# Altium schematic sheet THS788_2.SchDoc: FIT_PM12 board
size 420 x 297 mm; CheckedBy: G.Kasprowicz; Author: INR Moscow; CompanyName: WUT ISE; DrawnBy: M.Podgórski; Organization: WUT ISE; Address1: PW ISE; Address2: Nowowiejska 15/19 00-665 Warsaw; Address3: gkasprow@gmail.com; DocumentNumber: 23; Revision: 2; SheetNumber: 34; SheetTotal: 34; ModifiedBy: -; CheckedDate: -; Title2: TDC2; DivGrp: WUT ISE; Designer: INR RAS; ModifiedDate: -; ProjectName: Sensor Box
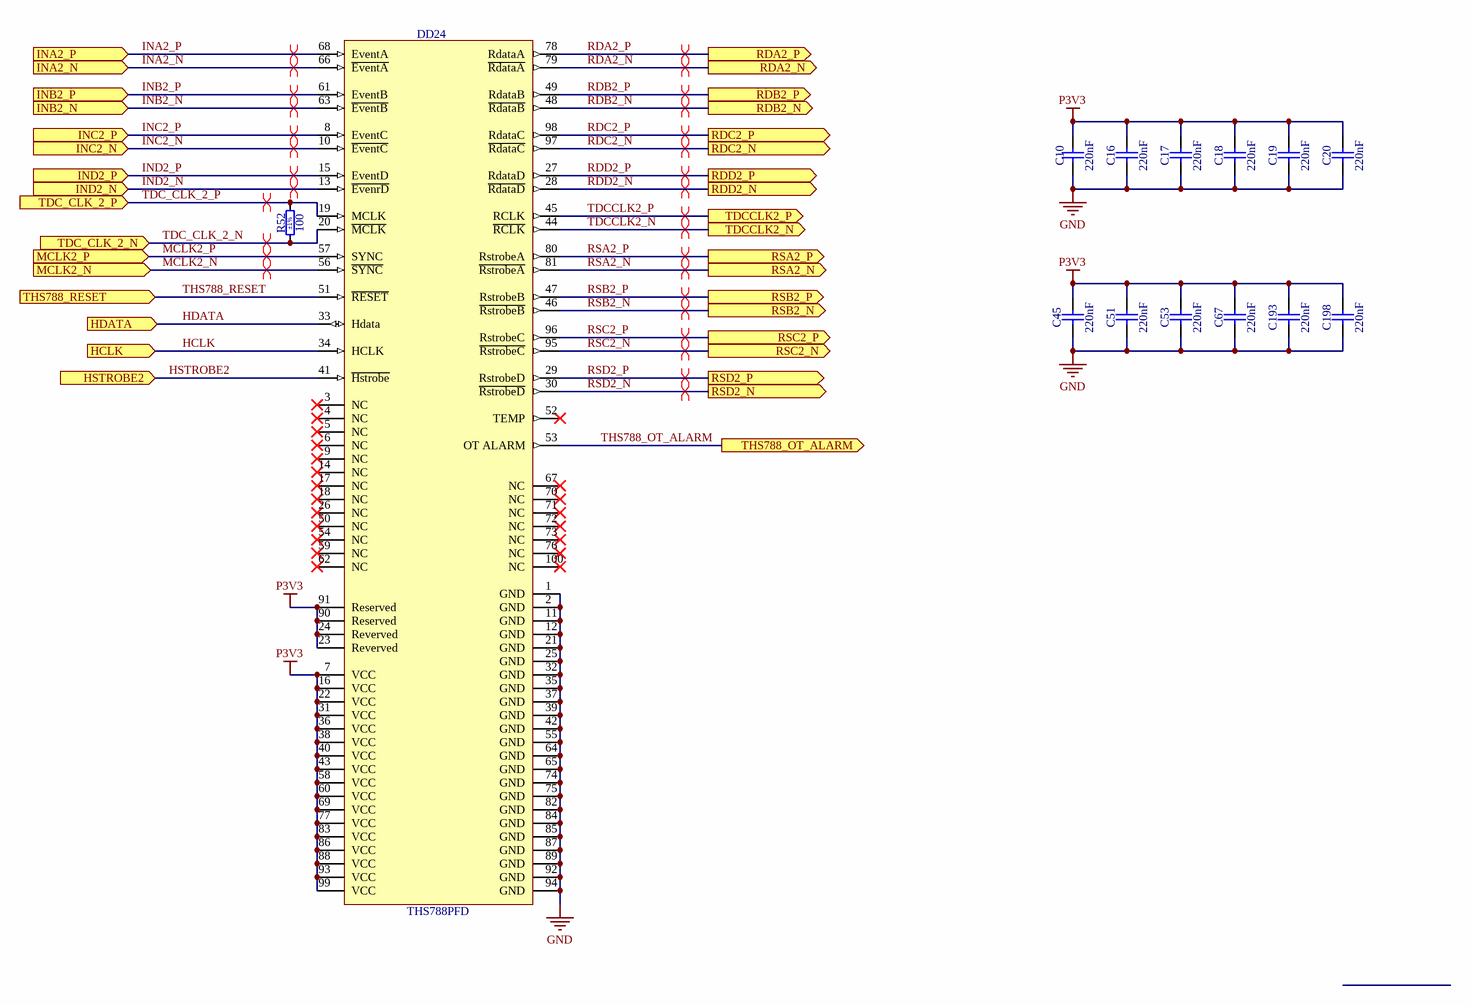
[diagram p0: THS788_2.SchDoc]

## Parts
C10  220nF  [CAPC2012X135N]
C16  220nF  [CAPC2012X135N]
C17  220nF  [CAPC2012X135N]
C18  220nF  [CAPC2012X135N]
C19  220nF  [CAPC2012X135N]
C20  220nF  [CAPC2012X135N]
C45  220nF  [CAPC2012X135N]
C51  220nF  [CAPC2012X135N]
C53  220nF  [CAPC2012X135N]
C67  220nF  [CAPC2012X135N]
C193  220nF  [CAPC2012X135N]
C198  220nF  [CAPC2012X135N]
DD24  THS788PFD  [TEXAS_PFD (S-PQFP-G100)]
R52  100  Tolerance: ±1%  [RESC1608X55N]

## Ports
HCLK (in), HDATA (in), HSTROBE2 (in), INA2_N (in), INA2_P (in), INB2_N (in), INB2_P (in), INC2_N (in), INC2_P (in), IND2_N (in), IND2_P (in), MCLK2_N (in), MCLK2_P (in), RDA2_N (out), RDA2_P (out), RDB2_N (out), RDB2_P (out), RDC2_N (out), RDC2_P (out), RDD2_N (out), RDD2_P (out), RSA2_N (out), RSA2_P (out), RSB2_N (out), RSB2_P (out), RSC2_N (out), RSC2_P (out), RSD2_N (out), RSD2_P (out), TDC_CLK_2_N (in), TDC_CLK_2_P (in), TDCCLK2_N (out), TDCCLK2_P (out), THS788_OT_ALARM (out), THS788_RESET (in)

## Nets
GND: C10.1 C16.1 C17.1 C18.1 C19.1 C20.1 C45.1 C51.1 C53.1 C67.1 C193.1 C198.1 DD24.1(GND) DD24.2(GND) DD24.11(GND) DD24.12(GND) DD24.21(GND) DD24.25(GND) DD24.32(GND) DD24.35(GND) DD24.37(GND) DD24.39(GND) DD24.42(GND) DD24.55(GND) DD24.64(GND) DD24.65(GND) DD24.74(GND) DD24.75(GND) DD24.82(GND) DD24.84(GND) DD24.85(GND) DD24.87(GND) DD24.89(GND) DD24.92(GND) DD24.94(GND)
P3V3: C10.2 C16.2 C17.2 C18.2 C19.2 C20.2 C45.2 C51.2 C53.2 C67.2 C193.2 C198.2 DD24.7(VCC) DD24.16(VCC) DD24.22(VCC) DD24.23(Reverved) DD24.24(Reverved) DD24.31(VCC) DD24.36(VCC) DD24.38(VCC) DD24.40(VCC) DD24.43(VCC) DD24.58(VCC) DD24.60(VCC) DD24.69(VCC) DD24.77(VCC) DD24.83(VCC) DD24.86(VCC) DD24.88(VCC) DD24.90(Reserved) DD24.91(Reserved) DD24.93(VCC) DD24.99(VCC)
HCLK: DD24.34(HCLK) ; port HCLK
HDATA: DD24.33(Hdata) ; port HDATA
HSTROBE2: DD24.41(~{Hstrobe}) ; port HSTROBE2
INA2_N: DD24.66(~{EventA}) ; port INA2_N
INA2_P: DD24.68(EventA) ; port INA2_P
INB2_N: DD24.63(~{EventB}) ; port INB2_N
INB2_P: DD24.61(EventB) ; port INB2_P
INC2_N: DD24.10(~{EventC}) ; port INC2_N
INC2_P: DD24.8(EventC) ; port INC2_P
IND2_N: DD24.13(~{EvenrD}) ; port IND2_N
IND2_P: DD24.15(EventD) ; port IND2_P
MCLK2_N: DD24.56(~{SYNC}) ; port MCLK2_N
MCLK2_P: DD24.57(SYNC) ; port MCLK2_P
RDA2_N: DD24.79(~{RdataA}) ; port RDA2_N
RDA2_P: DD24.78(RdataA) ; port RDA2_P
RDB2_N: DD24.48(~{RdataB}) ; port RDB2_N
RDB2_P: DD24.49(RdataB) ; port RDB2_P
RDC2_N: DD24.97(~{RdataC}) ; port RDC2_N
RDC2_P: DD24.98(RdataC) ; port RDC2_P
RDD2_N: DD24.28(~{RdataD}) ; port RDD2_N
RDD2_P: DD24.27(RdataD) ; port RDD2_P
RSA2_N: DD24.81(~{RstrobeA}) ; port RSA2_N
RSA2_P: DD24.80(RstrobeA) ; port RSA2_P
RSB2_N: DD24.46(~{RstrobeB}) ; port RSB2_N
RSB2_P: DD24.47(RstrobeB) ; port RSB2_P
RSC2_N: DD24.95(~{RstrobeC}) ; port RSC2_N
RSC2_P: DD24.96(RstrobeC) ; port RSC2_P
RSD2_N: DD24.30(~{RstrobeD}) ; port RSD2_N
RSD2_P: DD24.29(RstrobeD) ; port RSD2_P
TDC_CLK_2_N: DD24.20(~{MCLK}) R52.1 ; port TDC_CLK_2_N
TDC_CLK_2_P: DD24.19(MCLK) R52.2 ; port TDC_CLK_2_P
TDCCLK2_N: DD24.44(~{RCLK}) ; port TDCCLK2_N
TDCCLK2_P: DD24.45(RCLK) ; port TDCCLK2_P
THS788_OT_ALARM: DD24.53(OT_ALARM) ; port THS788_OT_ALARM
THS788_RESET: DD24.51(~{RESET}) ; port THS788_RESET

Not connected (* = marked no-connect by the designer): DD24 3(NC)* 4(NC)* 5(NC)* 6(NC)* 9(NC)* 14(NC)* 17(NC)* 18(NC)* 26(NC)* 50(NC)* 52(TEMP)* 54(NC)* 59(NC)* 62(NC)* 67(NC)* 70(NC)* 71(NC)* 72(NC)* 73(NC)* 76(NC)* 100(NC)*

## Layout directives
differential pair: INA2_N, INA2_P, INB2_N, INB2_P, INC2_N, INC2_P, IND2_N, IND2_P, MCLK2_N, MCLK2_P, RDA2_N, RDA2_P, RDB2_N, RDB2_P, RDC2_N, RDC2_P, RDD2_N, RDD2_P, RSA2_N, RSA2_P, RSB2_N, RSB2_P, RSC2_N, RSC2_P, RSD2_N, RSD2_P, TDC_CLK_2_N, TDC_CLK_2_P, TDCCLK2_N, TDCCLK2_P

## Notes on the sheet
- Project/Equipment
- Document
- Designer
- Drawn by
- Check.by
- Copyright WUT ISE 2024.
  This documentation describes Open Hardware and is licensed under the CERN OHL v.2. You may redistribute and modify this documentation under the terms of the CERN OHL v.2. (http://ohwr.org/CERNOHL). This documentation is distributed WITHOUT ANY EXPRESS OR IMPLIED WARRANTY, INCLUDING OF MERCHANTABILITY, SATISFACTORY QUALITY AND FITNESS FOR A PARTICULAR PURPOSE. Please see the CERN OHL v.2 for applicable conditions.
- Contact
- File
- Last Mod.
- Print Date
- Sheet
- Size
- A3
- of
- Rev

## Library data of the parts
C10 C16-C20 C45 C51 C53 C67 C193 C198 = CC0805_220NF_50V_10%_X7R: Non-polarised capacitor; Part Description: SMD Multilayer Chip Ceramic Capacitor; Manufacturer: GENERIC; Manufacturer1 Part Number: GRM21BR71H224KA01L; Voltage: 50V; TC: X7R; Tolerance: ±10%; Part Number: CC0805_220NF_50V_10%_X7R; Component Kind: Standard; Component Type: Standard; Pin Count: 2; Value: 220nF; Status: Preferred; Manufacturer Part Number: CC0805_220NF_50V_10%_X7R; Case: 0805; Mounted: Yes; Socket: No; SMD: Yes; Sense: No; Manufacturer1 Example: MURATA; Manufacturer1 ComponentHeight: 1.35mm; HelpURL: \\cern.ch\dfs\Applications\Altium\Datasheets\CC0805_X7R_MURATA.pdf; Author: CERN DEM JLC; CreateDate: 03.12.2007; LatestRevisionDate: 03.12.2007
DD24 = THS788PFD: Quad-Channel Time Measurement Unit (TMU); Manufacturer: TEXAS INSTRUMENTS; PressFit: No; Bonding: No; Part Number: THS788PFD; Component Kind: Standard; Component Type: Standard; Device: THS788PFD; Footprint: TEXAS_2PFD (S-PQFP-G100); PackageDescription: QFP, 0.50mm Pitch, Square; 100 Pin, 14.0mm L X 14.0mm W X 1.20mm H body (w/Thermal Tab 6.0 X 6.0mm), IPC Medium Density; Status: Not Recommended; Part Description: Quad-Channel Time Measurement Unit (TMU); Manufacturer Part Number: THS788PFD; Pin Count: 101; Case: QFP100; Mounted: Yes; Socket: No; SMD: Yes; Sense: No; ComponentHeight: 1.2mm; Author: CERN DEM HF; HelpURL: \\cern.ch\dfs\Applications\Altium\Datasheets\THS788.pdf; CreateDate: 10.06.2024; LatestRevisionDate: 10.06.2024
R52 = R0603_100R_1%_0.1W_100PPM: Resistor - 1%; Part Description: General Purpose Thick Film Chip Resistor; Manufacturer: GENERIC; Manufacturer1 Part Number: NRC06F4700TRF; Power: 0.1W; TC: ±100ppm/°C; PressFit: No; Part Number: R0603_100R_1%_0.1W_100PPM; Component Kind: Standard; Component Type: Standard; Pin Count: 2; Value: 100; Status: Preferred; Manufacturer Part Number: R0603_100R_1%_0.1W_100PPM; Case: 0603; Mounted: Yes; Sense: No; Socket: No; SMD: Yes; Manufacturer1 Example: NIC COMPONENT; Manufacturer1 ComponentHeight: 0.55mm; HelpURL: \\cern.ch\dfs\Applications\Altium\Datasheets\R0603_2NIC_2NRC.pdf; Author: CERN DEM JLC; CreateDate: 03.12.2007; LatestRevisionDate: 13.03.2008